# Altium schematic sheet TH8_LEDs.SchDoc
size A4
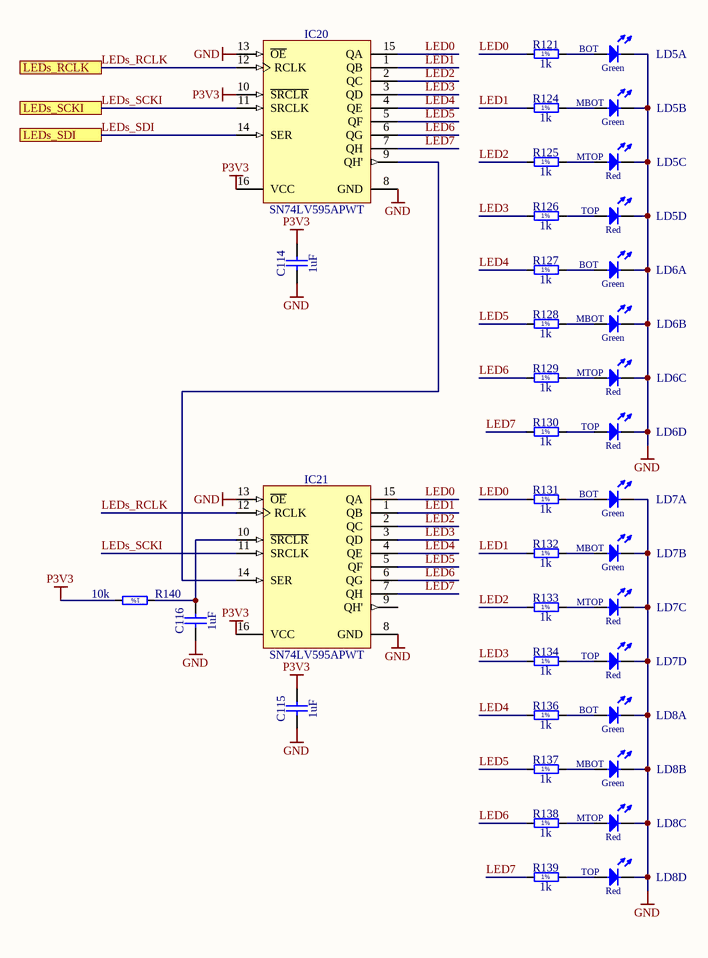
[diagram p0: TH8_LEDs.SchDoc]

## Parts
C114  1uF  [CAPC1608X87N]
C115  1uF  [CAPC1608X87N]
C116  1uF  [CAPC1608X87N]
IC20  SN74LV595APWT  [SOP65P640X120-16N]
IC21  SN74LV595APWT  [SOP65P640X120-16N]
LD5  Green/Green/HeRed/HeRed  [LED_BIVAR_H485CHHGGDL]  (value not drawn)  (parts A,B,C,D of 4)
LD6  Green/Green/HeRed/HeRed  [LED_BIVAR_H485CHHGGDL]  (value not drawn)  (parts A,B,C,D of 4)
LD7  Green/Green/HeRed/HeRed  [LED_BIVAR_H485CHHGGDL]  (value not drawn)  (parts A,B,C,D of 4)
LD8  Green/Green/HeRed/HeRed  [LED_BIVAR_H485CHHGGDL]  (value not drawn)  (parts A,B,C,D of 4)
R121  1k  [RESC1005X40N]
R124  1k  [RESC1005X40N]
R125  1k  [RESC1005X40N]
R126  1k  [RESC1005X40N]
R127  1k  [RESC1005X40N]
R128  1k  [RESC1005X40N]
R129  1k  [RESC1005X40N]
R130  1k  [RESC1005X40N]
R131  1k  [RESC1005X40N]
R132  1k  [RESC1005X40N]
R133  1k  [RESC1005X40N]
R134  1k  [RESC1005X40N]
R136  1k  [RESC1005X40N]
R137  1k  [RESC1005X40N]
R138  1k  [RESC1005X40N]
R139  1k  [RESC1005X40N]
R140  10k  [RESC1005X40N]

## Ports
LEDs_RCLK, LEDs_SCKI, LEDs_SDI

## Nets
GND: C114.1 C115.1 C116.1 IC20.8(GND) IC20.13(~{OE}) IC21.8(GND) IC21.13(~{OE}) LD5.1(C) LD5.3(C) LD5.5(C) LD5.7(C) LD6.1(C) LD6.3(C) LD6.5(C) LD6.7(C) LD7.1(C) LD7.3(C) LD7.5(C) LD7.7(C) LD8.1(C) LD8.3(C) LD8.5(C) LD8.7(C)
P3V3: C114.2 C115.2 IC20.10(~{SRCLR}) IC20.16(VCC) IC21.16(VCC) R140.2
LED0: IC20.15(QA) IC21.15(QA) R121.1 R131.1
LED1: IC20.1(QB) IC21.1(QB) R124.1 R132.1
LED2: IC20.2(QC) IC21.2(QC) R125.1 R133.1
LED3: IC20.3(QD) IC21.3(QD) R126.1 R134.1
LED4: IC20.4(QE) IC21.4(QE) R127.1 R136.1
LED5: IC20.5(QF) IC21.5(QF) R128.1 R137.1
LED6: IC20.6(QG) IC21.6(QG) R129.1 R138.1
LED7: IC20.7(QH) IC21.7(QH) R130.1 R139.1
LEDs_RCLK: IC20.12(RCLK) IC21.12(RCLK) ; port LEDs_RCLK
LEDs_SCKI: IC20.11(SRCLK) IC21.11(SRCLK) ; port LEDs_SCKI
LEDs_SDI: IC20.14(SER) ; port LEDs_SDI
NetC116_2: C116.2 IC21.10(~{SRCLR}) R140.1
NetIC20_9: IC20.9(QH') IC21.14(SER)
NetLD5_2: LD5.2(A) R121.2
NetLD5_4: LD5.4(A) R124.2
NetLD5_6: LD5.6(A) R125.2
NetLD5_8: LD5.8(A) R126.2
NetLD6_2: LD6.2(A) R127.2
NetLD6_4: LD6.4(A) R128.2
NetLD6_6: LD6.6(A) R129.2
NetLD6_8: LD6.8(A) R130.2
NetLD7_2: LD7.2(A) R131.2
NetLD7_4: LD7.4(A) R132.2
NetLD7_6: LD7.6(A) R133.2
NetLD7_8: LD7.8(A) R134.2
NetLD8_2: LD8.2(A) R136.2
NetLD8_4: LD8.4(A) R137.2
NetLD8_6: LD8.6(A) R138.2
NetLD8_8: LD8.8(A) R139.2

Not connected (* = marked no-connect by the designer): IC21 9(QH')

## Notes on the sheet
- (in symbol LED_BIVAR_H485CHHGGDL, part A) BOT; Green
- (in symbol LED_BIVAR_H485CHHGGDL, part B) MBOT; Green
- (in symbol LED_BIVAR_H485CHHGGDL, part C) MTOP; Red
- (in symbol LED_BIVAR_H485CHHGGDL, part D) TOP; Red
- (in symbol R0402_1K_1%_0.0625W_100PPM) 1%
- (in symbol R0402_10K_1%_0.0625W_100PPM) 1%

## Library data of the parts
C114-C116 = CC0603_1UF_25V_10%_X7R: Non-polarised capacitor; Part Description: SMD Multilayer Chip Ceramic Capacitor; Manufacturer: GENERIC; Manufacturer1 Part Number: GRM188R71E105KA12D; Voltage: 25V; TC: X7R; Tolerance: ±10%; Part Number: CC0603_1UF_25V_10%_X7R; Component Kind: Standard; Component Type: Standard; Pin Count: 2; Value: 1uF; Status: None; Manufacturer Part Number: CC0603_1UF_25V_10%_X7R; Case: 0603; Mounted: Yes; Socket: No; SMD: Yes; Sense: No; Manufacturer1 Example: MURATA; Manufacturer1 ComponentHeight: 0.9mm; HelpURL: \\cern.ch\dfs\Applications\Altium\Datasheets\CC0603_X7R_MURATA.pdf; Author: CERN DEM JLC; CreateDate: 18.01.2011; LatestRevisionDate: 18.01.2011
IC20 IC21 = SN74LV595APWT: 8-Bit Shift Register With 3-State Output Register; Manufacturer: TEXAS INSTRUMENTS; PressFit: No; Bonding: No; Part Number: SN74LV595APWT; Component Kind: Standard; Component Type: Standard; Device: SN74LV595APWT; PackageDescription: SOP, 0.65mm pitch; 16 pin, 4.40mm W X 5.00mm L X 1.20mm H body IPC Medium Density; Part Description: 8-Bit Shift Register With 3-State Output Register; Manufacturer Part Number: SN74LV595APWT; Pin Count: 16; Case: TSSOP16; Mounted: Yes; Socket: No; SMD: Yes; Sense: No; ComponentHeight: 1.2mm; Author: CERN DEM JLC; HelpURL: \\cern.ch\dfs\Applications\Altium\Datasheets\SN74LV595APWT.pdf; CreateDate: 10.05.2012; LatestRevisionDate: 10.05.2012
LD5-LD8 = LED_BIVAR_H485CHHGGDL: LED x4 G-1C2A-BOT_G-3C4A_H-5C6A_H-7C8A-TOP; Part Description: Quad-Level 2mm (Green+Green+HeRed+HeRed) LED, PCB Edge Mounting; Manufacturer: BIVAR; PressFit: No; Bonding: No; Part Number: LED_BIVAR_H485CHHGGDL; Component Kind: Standard; Component Type: Standard; Color: Green/Green/HeRed/HeRed; PackageDescription: Quad-Level 2mm (Green+Green+HeRed+HeRed) LED, PCB Edge Mounting  BIVAR H485C Serie; Status: Not Recommended; Manufacturer Part Number: H485CHHGGDL; Pin Count: 8; Mounted: Yes; Socket: No; SMD: No; Sense: No; ComponentHeight: 11.3mm; HelpURL: \\cern.ch\dfs\Applications\Altium\Datasheets\LED_BIVAR_H485C.pdf; Author: CERN DEM BC; CreateDate: 12.11.2015; LatestRevisionDate: 12.11.2015
R121 R124-R134 R136-R139 = R0402_1K_1%_0.0625W_100PPM: Resistor - 1%; Part Description: General Purpose Thick Film Chip Resistor; Manufacturer: GENERIC; Manufacturer1 Part Number: 232270671002L; TC: ±100ppm/°C; PressFit: No; Part Number: R0402_1K_1%_0.0625W_100PPM; Component Kind: Standard; Component Type: Standard; Pin Count: 2; Value: 1k; Status: Not Recommended; Power: 0.0625W; Tolerance: ±1%; Manufacturer Part Number: R0402_1K_1%_0.0625W_100PPM; Case: 0402; Mounted: Yes; Sense: No; Socket: No; SMD: Yes; Manufacturer1 Example: YAGEO PHYCOMP; Manufacturer1 ComponentHeight: 0.4mm; HelpURL: \\cern.ch\dfs\Applications\Altium\Datasheets\R0402_Phycomp_RC0402.pdf; Author: CERN DEM JLC; CreateDate: 03.12.2007; LatestRevisionDate: 17.10.2012
R140 = R0402_10K_1%_0.0625W_100PPM: Resistor - 1%; Part Description: General Purpose Thick Film Chip Resistor; Manufacturer: GENERIC; Manufacturer1 Part Number: 232270671003L; TC: ±100ppm/°C; PressFit: No; Value: 10k; Part Number: R0402_10K_1%_0.0625W_100PPM; Component Kind: Standard; Component Type: Standard; Pin Count: 2; Status: Not Recommended; Power: 0.0625W; Tolerance: ±1%; Manufacturer Part Number: R0402_10K_1%_0.0625W_100PPM; Case: 0402; Mounted: Yes; Sense: No; Socket: No; SMD: Yes; Manufacturer1 Example: YAGEO PHYCOMP; Manufacturer1 ComponentHeight: 0.4mm; HelpURL: \\cern.ch\dfs\Applications\Altium\Datasheets\R0402_Phycomp_RC0402.pdf; Author: CERN DEM JLC; CreateDate: 03/12/2007; LatestRevisionDate: 17/10/2012